# Altium schematic sheet cpu.SchDoc
size A4
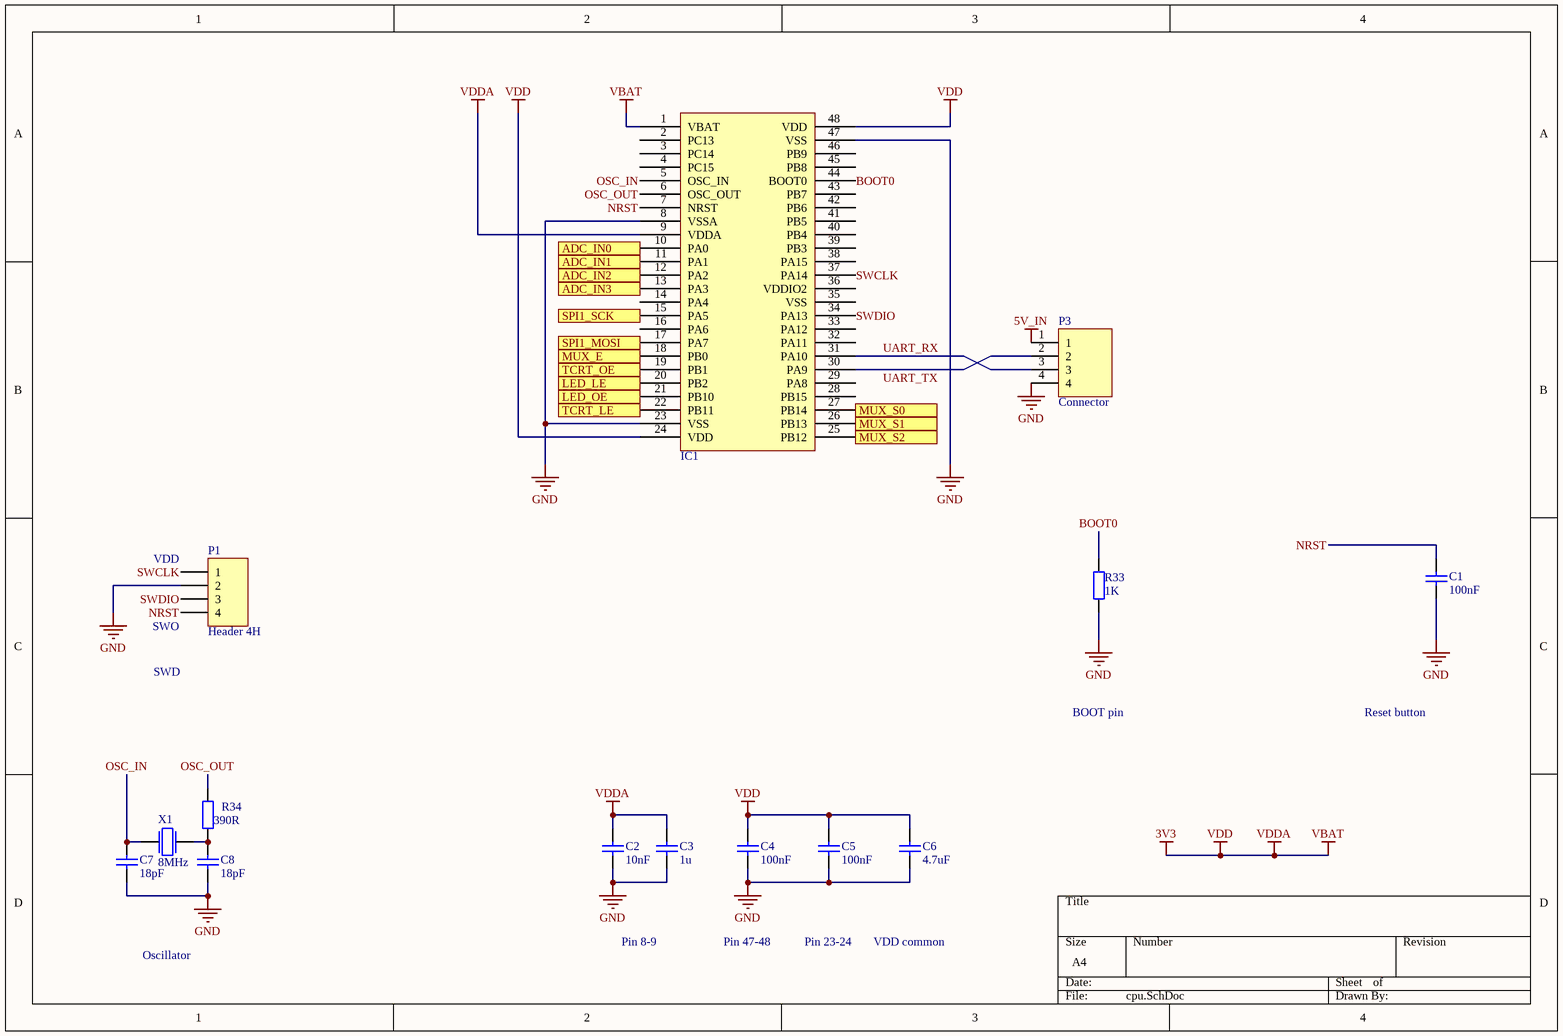
[diagram p0: cpu.SchDoc]

## Parts
C1  100nF  [FP_0805_CAP_085]
C2  10nF  [FP_0805_CAP_085]
C3  1u  [FP_0805_CAP_085]
C4  100nF  [FP_0805_CAP_085]
C5  100nF  [FP_0805_CAP_085]
C6  4.7uF  [FP_0805_CAP_085]
C7  18pF  [FP_0805_CAP_085]
C8  18pF  [FP_0805_CAP_085]
IC1  STM32F030C8T6  [LQFP48]  (value not drawn)
P1  Header 4H  [HDR1X4H]
P3  Connector  [FP_CONN4_TAP_254MM_90]
R33  1K  [FP_0805_RES]
R34  390R  [FP_0805_RES]
X1  8MHz  [FP_CRYSTAL_HC49]

## Ports
ADC_IN0 (in), ADC_IN1 (in), ADC_IN2 (in), ADC_IN3 (in), LED_LE (out), LED_OE (out), MUX_E (out), MUX_S0 (out), MUX_S1 (out), MUX_S2 (out), SPI1_MOSI (out), SPI1_SCK (out), TCRT_LE (out), TCRT_OE (out)

## Nets
3V3: C2.2 C3.2 C4.2 C5.2 C6.2 IC1.1(VBAT) IC1.9(VDDA) IC1.24(VDD) IC1.48(VDD)  [also labelled VBAT, VDD, VDDA]
5V_IN: P3.1
GND: C1.1 C2.1 C3.1 C4.1 C5.1 C6.1 C7.1 C8.1 IC1.8(VSSA) IC1.23(VSS) IC1.47(VSS) P1.2 P3.4 R33.1
ADC_IN0: IC1.10(PA0) ; port ADC_IN0
ADC_IN1: IC1.11(PA1) ; port ADC_IN1
ADC_IN2: IC1.12(PA2) ; port ADC_IN2
ADC_IN3: IC1.13(PA3) ; port ADC_IN3
BOOT0: IC1.44(BOOT0) R33.2
LED_LE: IC1.20(PB2) ; port LED_LE
LED_OE: IC1.21(PB10) ; port LED_OE
MUX_E: IC1.18(PB0) ; port MUX_E
MUX_S0: IC1.27(PB14) ; port MUX_S0
MUX_S1: IC1.26(PB13) ; port MUX_S1
MUX_S2: IC1.25(PB12) ; port MUX_S2
NRST: C1.2 IC1.7(NRST) P1.4
OSC_IN: C7.2 IC1.5(OSC_IN) X1.1
OSC_OUT: IC1.6(OSC_OUT) R34.2
SPI1_MOSI: IC1.17(PA7) ; port SPI1_MOSI
SPI1_SCK: IC1.15(PA5) ; port SPI1_SCK
SWCLK: IC1.37(PA14) P1.1
SWDIO: IC1.34(PA13) P1.3
TCRT_LE: IC1.22(PB11) ; port TCRT_LE
TCRT_OE: IC1.19(PB1) ; port TCRT_OE
UART_RX: IC1.31(PA10) P3.3
UART_TX: IC1.30(PA9) P3.2
NetC8_2: C8.2 R34.1 X1.2

Not connected (* = marked no-connect by the designer): IC1 2(PC13) 3(PC14) 4(PC15) 14(PA4) 16(PA6) 28(PB15) 29(PA8) 32(PA11) 33(PA12) 35(VSS) 36(VDDIO2) 38(PA15) 39(PB3) 40(PB4) 41(PB5) 42(PB6) 43(PB7) 45(PB8) 46(PB9)

## Notes on the sheet
- (near P1) VDD
- (near P1) SWO
- SWD
- BOOT pin
- Reset button
- Oscillator
- Pin 8-9
- Pin 47-48
- Pin 23-24
- VDD common

## Library data of the parts
C1 C4 C5 = CAP 100nF: Capacitor; Voltage: 50V; Name: 100nF 0805 10% 50V X7R 0805B104K500CT (WAL); Supplier: Lomex; Reference: 82-10-76; Value: 100nF
C2 = CAP 10nF: Capacitor; Name: 10nF 0805 10% 50V X7R 0805B103K500NT (FNG); Supplier: Lomex; Reference: 82-13-45; Value: 10nF
C3 = CAP: Capacitor; Name: 1uF 0805 -20+80% 50V Y5V 0805F105Z500CT (WAL); Supplier: Lomex; Reference: 82-04-25; Value: 1u
C6 = CAP 47uF: Capacitor; Name: 4.7uF 0805 10% 16V X5R 0805X475K160CT (WAL); Supplier: Lomex; Reference: 82-11-20; Value: 4.7uF
C7 C8 = CAP: Capacitor; Name: 18pF 0805 5% 50V NP0 0805N180J500CT (WAL); Supplier: Lomex; Reference: 82-12-79; Value: 18pF
IC1 = STM32F030C8T6: STM32F030C8T6 ARM MCU; Reference: 2393634; Name: ARM MCU, Value Line, STM32 Family STM32F0 Series Microcontrollers; Supplier: Farnell
P1 = Header 4H: Header, 4-Pin, Right Angle; Name: 90° pin header; LatestRevisionDate: 17-Jul-2002; LatestRevisionNote: Re-released for DXP Platform.; Publisher: Altium Limited
P3 = Connector_4pin: 4pin Connector; Name: TÁPCSATL. 2.54mm 4P APA 90° NCW254-04R (G-S) FORR.; Reference: 43-09-96; Supplier: Lomex
R33 = RES: Resistor; Name: 1K00 0805 5% RC0805JR-101KL 0.125W (YAG); Supplier: Lomex; Reference: 81-34-72; Value: 1K
R34 = RES 390R: Resistor; Name: 390R 0805 5% WR08X391JTL 0.125W (WAL); Supplier: Lomex; Reference: 81-30-13; Value: 390R
X1 = Crystal: Quarz Crystal; Reference: 2508448; Name: Crystal, 8 MHz, Through Hole; Value: 8MHz; Supplier: Farnell